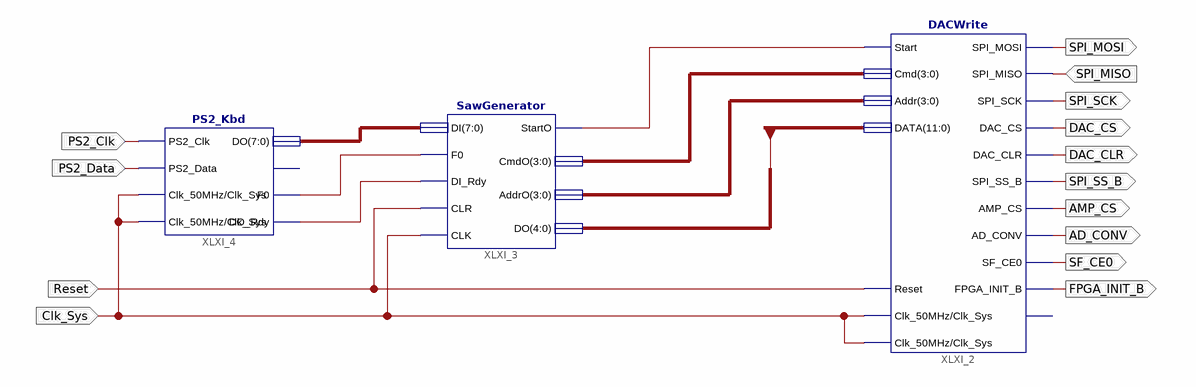
[diagram p0: schematic sheet 1]
// Xilinx ISE schematic Organy.sch (artix7) as structural Verilog: 3 symbols, 14 ports
module Organy (
  input  PS2_Clk,
  input  PS2_Data,
  input  SPI_MISO,
  input  Reset,
  input  Clk_Sys,
  output SPI_MOSI,
  output SPI_SCK,
  output DAC_CS,
  output DAC_CLR,
  output SPI_SS_B,
  output AMP_CS,
  output AD_CONV,
  output SF_CE0,
  output FPGA_INIT_B
);

  wire XLXN_6, XLXN_35, XLXN_36;
  wire [3:0] XLXN_4, XLXN_5;
  wire [7:0] XLXN_34;
  wire [11:0] DATA;

  DACWrite XLXI_2 (
    .Reset(Reset), .Start(XLXN_6), .SPI_MISO(SPI_MISO), .Cmd(XLXN_5), .Addr(XLXN_4), .DATA(DATA),
    .DAC_CLR(DAC_CLR), .DAC_CS(DAC_CS), .SPI_MOSI(SPI_MOSI), .SPI_SCK(SPI_SCK), .SPI_SS_B(SPI_SS_B),
    .AMP_CS(AMP_CS), .AD_CONV(AD_CONV), .SF_CE0(SF_CE0), .FPGA_INIT_B(FPGA_INIT_B), .Clk_50MHz(Clk_Sys),
    .Clk_Sys(Clk_Sys));  // open: Busy
  SawGenerator XLXI_3 (
    .CLK(Clk_Sys), .CLR(Reset), .DI_Rdy(XLXN_36), .F0(XLXN_35), .DI(XLXN_34), .StartO(XLXN_6), .CmdO(XLXN_5),
    .AddrO(XLXN_4), .DO(DATA[4:0]));
  PS2_Kbd XLXI_4 (
    .PS2_Clk(PS2_Clk), .PS2_Data(PS2_Data), .Clk_50MHz(Clk_Sys), .F0(XLXN_35), .DO_Rdy(XLXN_36),
    .DO(XLXN_34), .Clk_Sys(Clk_Sys));  // open: E0
endmodule
